# Altium schematic sheet Fan and Pump Headers.SchDoc
size A; SheetNumber: 12; SheetTotal: 19
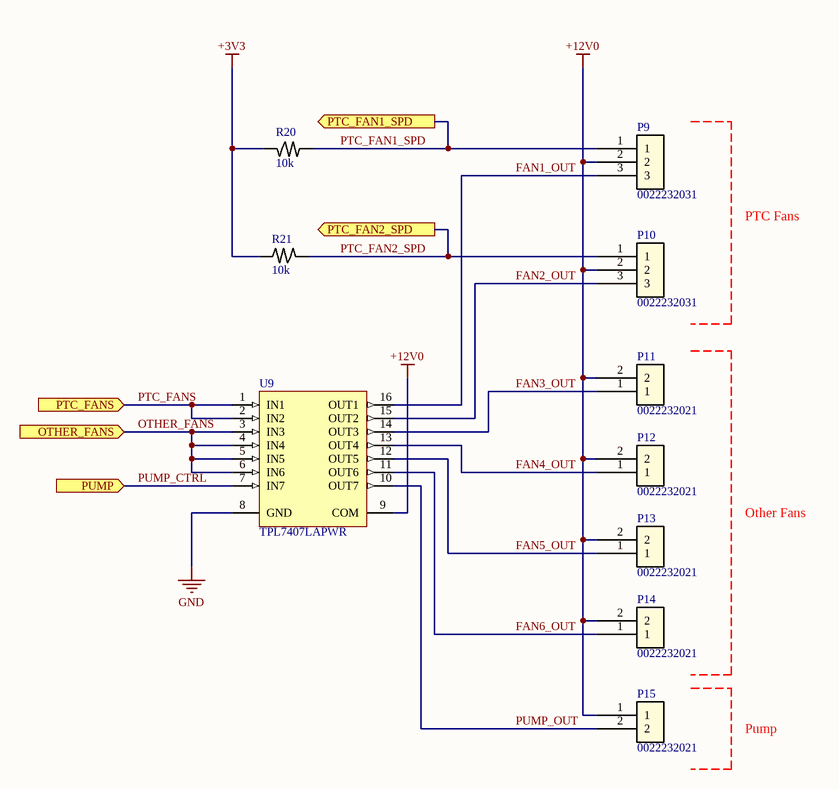
[diagram p0: Fan and Pump Headers.SchDoc]

## Parts
P9  0022232031  [Signal3]
P10  0022232031  [Signal3]
P11  0022232021  [Signal2]
P12  0022232021  [Signal2]
P13  0022232021  [Signal2]
P14  0022232021  [Signal2]
P15  0022232021  [Signal2]
R20  10k  [R0603]
R21  10k  [R0603]
U9  TPL7407LAPWR  [TSSOP-16]

## Ports
OTHER_FANS (in), PTC_FAN1_SPD (out), PTC_FAN2_SPD (out), PTC_FANS (in), PUMP (in)

## Nets
+3V3: R20.2 R21.1
+12V0: P9.2 P10.2 P11.2 P12.2 P13.2 P14.2 P15.1 U9.9(COM)
GND: U9.8(GND)
FAN1_OUT: P9.3 U9.16(OUT1)
FAN2_OUT: P10.3 U9.15(OUT2)
FAN3_OUT: P11.1 U9.14(OUT3)
FAN4_OUT: P12.1 U9.13(OUT4)
FAN5_OUT: P13.1 U9.12(OUT5)
FAN6_OUT: P14.1 U9.11(OUT6)
OTHER_FANS: U9.3(IN3) U9.4(IN4) U9.5(IN5) U9.6(IN6) ; port OTHER_FANS
PTC_FAN1_SPD: P9.1 R20.1 ; port PTC_FAN1_SPD
PTC_FAN2_SPD: P10.1 R21.2 ; port PTC_FAN2_SPD
PTC_FANS: U9.1(IN1) U9.2(IN2) ; port PTC_FANS
PUMP_CTRL: U9.7(IN7) ; port PUMP
PUMP_OUT: P15.2 U9.10(OUT7)

## Notes on the sheet
- PTC Fans
- Other Fans
- Pump
- Project:
- Sheet Title:
- Size
- Date:
- A
- Sheet Number:
- Sheet Total:
- Revision:
- Time:
- Author:

## Library data of the parts
P9 P10 = Signal3: SignalConnector, 3 leads; MF: Molex; MP: 0022232031; ComponentLink1Description: Datasheet; ComponentLink1URL: https://tools.molex.com/pdm_docs/sd/022232031_sd.pdf; ComponentLink2Description: Supplier1; ComponentLink2URL: https://www.digikey.com/en/products/detail/molex/0022232031/26669
P11-P15 = Signal2: SignalConnector, 2 leads; MF: Molex; ComponentLink1Description: Datasheet; ComponentLink1URL: https://www.molex.com/content/dam/molex/molex-dot-com/products/automated/en-us/salesdrawingpdf/637/6373/022232021_sd.pdf?inline; ComponentLink2Description: Supplier1; ComponentLink2URL: https://www.digikey.com/en/products/detail/molex/0022232021/26667; MP: 0022232021
R20 R21 = Res: RES 10kΩ ±1% 100mW 0603; MF: FOJAN; MP: FRC0603F1002TS; ComponentLink1Description: Datasheet; ComponentLink1URL: https://www.lcsc.com/datasheet/C2906982.pdf; ComponentLink2Description: Supplier1; ComponentLink2URL: https://www.lcsc.com/product-detail/C2906982.html
U9 = TPL7407LAPWR FET Array: 7 Active High Low Side Switch TSSOP-16 Power Distribution Switches, Load Drivers ROHS; MF: Texas Instruments; ComponentLink1Description: Datasheet; ComponentLink1URL: https://www.ti.com/lit/ds/symlink/tpl7407la.pdf?ts=1759164854652&ref_url=https%253A%252F%252Fwww.google.com%252F; ComponentLink2Description: Supplier1; ComponentLink2URL: https://www.lcsc.com/product-detail/C2149827.html?s_z=n_tpl7407la; MP: TPL7407LAPWR